# Altium schematic sheet main.SchDoc
size A4; DocumentNumber: 1; SheetNumber: 2; SheetTotal: 5; SPICEModelCacheQOCYWOGJ: <root> / <DocumentId>QOCYWOGJ</DocumentId> / </root>
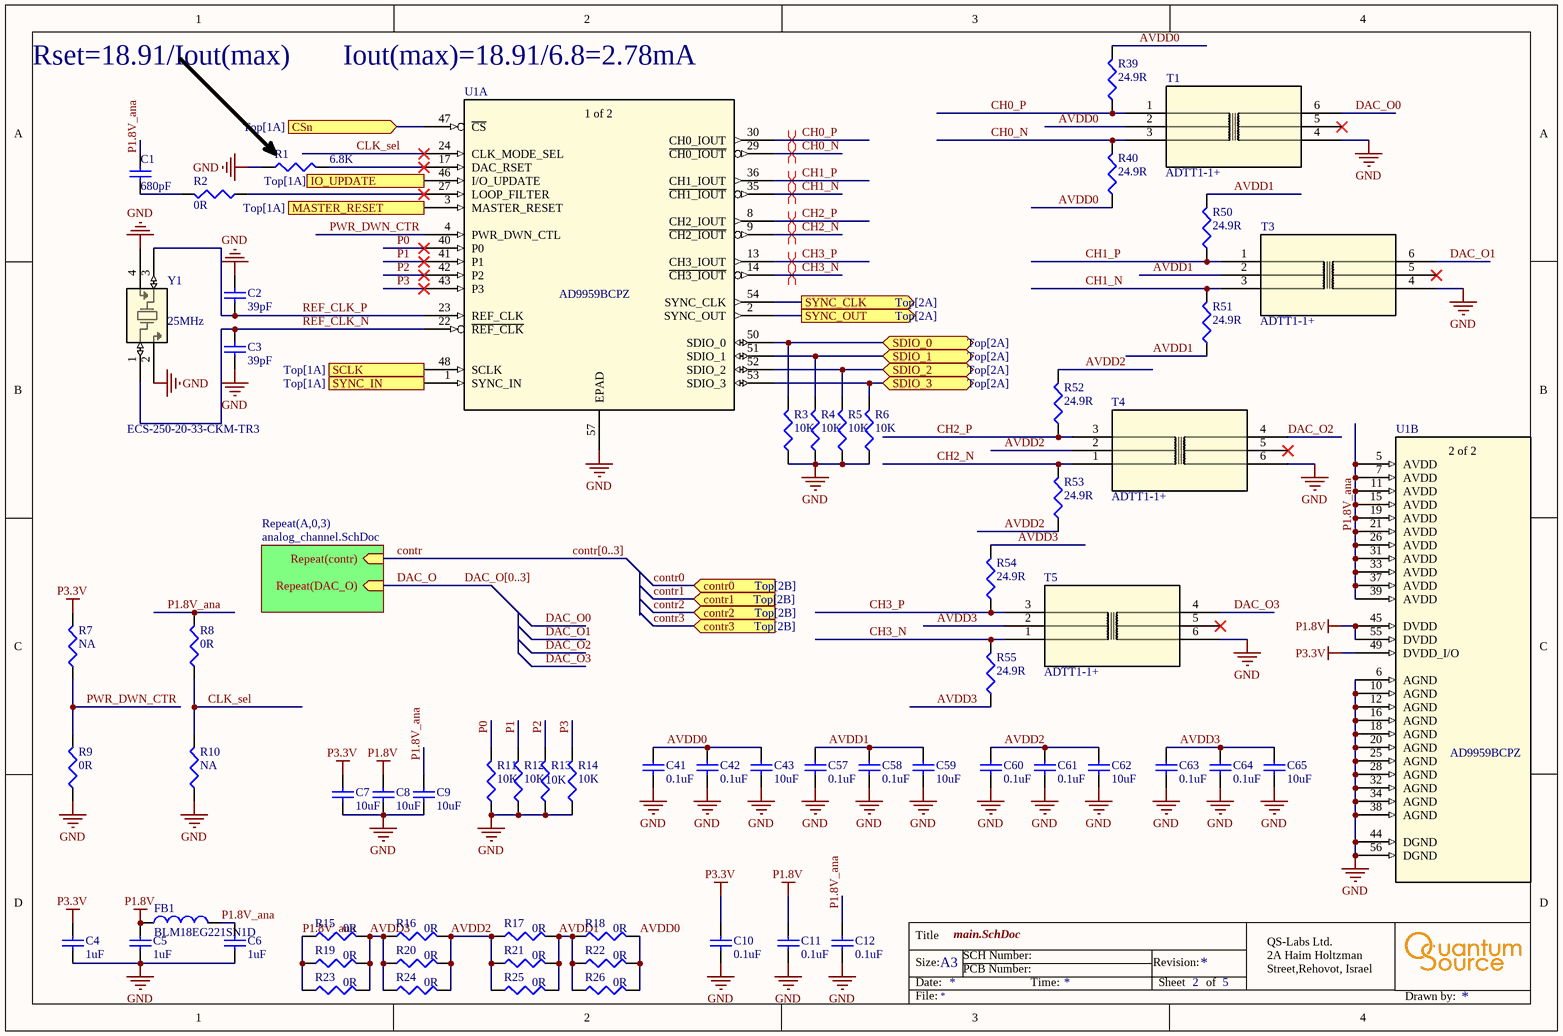
[diagram p0: main.SchDoc]

## Parts
C1  Capacitance: 680pF  [C0402]  (hidden comment: 680pF 50V)
C2  Capacitance: 39pF  [C0402]  (hidden comment: 39pF 50V)
C3  Capacitance: 39pF  [C0402]  (hidden comment: 39pF 50V)
C4  Capacitance: 1uF  [C0402]  (hidden comment: 1uF 25V)
C5  Capacitance: 1uF  [C0402]  (hidden comment: 1uF 25V)
C6  Capacitance: 1uF  [C0402]  (hidden comment: 1uF 25V)
C7  Capacitance: 10uF  [C0402]  (hidden comment: 10uF 10V)
C8  Capacitance: 10uF  [C0402]  (hidden comment: 10uF 10V)
C9  Capacitance: 10uF  [C0402]  (hidden comment: 10uF 10V)
C10  Capacitance: 0.1uF  [C0402]  (hidden comment: 0.1uF 50V)
C11  Capacitance: 0.1uF  [C0402]  (hidden comment: 0.1uF 50V)
C12  Capacitance: 0.1uF  [C0402]  (hidden comment: 0.1uF 50V)
C41  Capacitance: 0.1uF  [C0402]  (hidden comment: 0.1uF 50V)
C42  Capacitance: 0.1uF  [C0402]  (hidden comment: 0.1uF 50V)
C43  Capacitance: 10uF  [C0402]  (hidden comment: 10uF 10V)
C57  Capacitance: 0.1uF  [C0402]  (hidden comment: 0.1uF 50V)
C58  Capacitance: 0.1uF  [C0402]  (hidden comment: 0.1uF 50V)
C59  Capacitance: 10uF  [C0402]  (hidden comment: 10uF 10V)
C60  Capacitance: 0.1uF  [C0402]  (hidden comment: 0.1uF 50V)
C61  Capacitance: 0.1uF  [C0402]  (hidden comment: 0.1uF 50V)
C62  Capacitance: 10uF  [C0402]  (hidden comment: 10uF 10V)
C63  Capacitance: 0.1uF  [C0402]  (hidden comment: 0.1uF 50V)
C64  Capacitance: 0.1uF  [C0402]  (hidden comment: 0.1uF 50V)
C65  Capacitance: 10uF  [C0402]  (hidden comment: 10uF 10V)
FB1  BLM18EG221SN1D  [fb0603]
R1  6.8K  [R0402]
R2  0R  [R0402]
R3  10K  [R0402]
R4  10K  [R0402]
R5  10K  [R0402]
R6  10K  [R0402]
R7  NA  [R0402]
R8  0R  [R0402]
R9  0R  [R0402]
R10  NA  [R0402]
R11  10K  [R0402]
R12  10K  [R0402]
R13  10K  [R0402]
R14  10K  [R0402]
R15  0R  [R0805]
R16  0R  [R0805]
R17  0R  [R0805]
R18  0R  [R0805]
R19  0R  [R0805]
R20  0R  [R0805]
R21  0R  [R0805]
R22  0R  [R0805]
R23  0R  [R0805]
R24  0R  [R0805]
R25  0R  [R0805]
R26  0R  [R0805]
R39  24.9R  [R0402]
R40  24.9R  [R0402]
R50  24.9R  [R0402]
R51  24.9R  [R0402]
R52  24.9R  [R0402]
R53  24.9R  [R0402]
R54  24.9R  [R0402]
R55  24.9R  [R0402]
T1  ADTT1-1+  [CD542_MNC]
T3  ADTT1-1+  [CD542_MNC]
T4  ADTT1-1+  [CD542_MNC]
T5  ADTT1-1+  [CD542_MNC]
U1  AD9959BCPZ  [CP_56_1_ADI]  (parts A,B of 2)
Y1  ECS-250-20-33-CKM-TR3  [SMD4_ECX-32_3p2x2p5_ECS]

## Sub-sheets
Repeat(A,0,3) = analog_channel.SchDoc: Repeat(contr) (in), Repeat(DAC_O) (in)

## Ports
contr0 (in, see Top[2B]), contr1 (in, see Top[2B]), contr2 (in, see Top[2B]), contr3 (in, see Top[2B]), CSn (in, see Top[1A]), IO_UPDATE (in, see Top[1A]), MASTER_RESET (in, see Top[1A]), SCLK (in, see Top[1A]), SDIO_0 (bidir, see Top[2A]), SDIO_1 (bidir, see Top[2A]), SDIO_2 (bidir, see Top[2A]), SDIO_3 (bidir, see Top[2A]), SYNC_CLK (out, see Top[2A]), SYNC_IN (in, see Top[1A]), SYNC_OUT (out, see Top[2A])

## Nets
GND: C2.2 C3.1 C4.1 C5.1 C6.1 C7.1 C8.1 C9.1 C10.1 C11.1 C12.1 C41.1 C42.1 C43.1 C57.1 C58.1 C59.1 C60.1 C61.1 C62.1 C63.1 C64.1 C65.1 R1.1 R3.1 R4.1 R5.1 R6.1 R9.1 R10.1 R11.1 R12.1 R13.1 R14.1 T1.4 T3.4 T4.6 T5.6 U1.6(AGND) U1.10(AGND) U1.12(AGND) U1.16(AGND) U1.18(AGND) U1.20(AGND) U1.25(AGND) U1.28(AGND) U1.32(AGND) U1.34(AGND) U1.38(AGND) U1.44(DGND) U1.56(DGND) U1.57(EPAD) Y1.2 Y1.4
P1.8V: C5.2 C8.2 C11.2 FB1.1 U1.45(DVDD) U1.55(DVDD)
P3.3V: C4.2 C7.2 C10.2 R7.2 U1.49(DVDD_I/O)
AVDD0: C41.2 C42.2 C43.2 R18.2 R22.2 R26.2 R39.2 R40.1 T1.2
AVDD1: C57.2 C58.2 C59.2 R17.2 R18.1 R21.2 R22.1 R25.2 R26.1 R50.2 R51.1 T3.2
AVDD2: C60.2 C61.2 C62.2 R16.2 R17.1 R20.2 R21.1 R24.2 R25.1 R52.2 R53.1 T4.2
AVDD3: C63.2 C64.2 C65.2 R15.2 R16.1 R19.2 R20.1 R23.2 R24.1 R54.2 R55.1 T5.2
CH0_N: R40.2 T1.3 U1.29(~{CH0_IOUT})
CH0_P: R39.1 T1.1 U1.30(CH0_IOUT)
CH1_N: R51.2 T3.3 U1.35(~{CH1_IOUT})
CH1_P: R50.1 T3.1 U1.36(CH1_IOUT)
CH2_N: R53.2 T4.1 U1.9(~{CH2_IOUT})
CH2_P: R52.1 T4.3 U1.8(CH2_IOUT)
CH3_N: R55.2 T5.1 U1.14(~{CH3_IOUT})
CH3_P: R54.1 T5.3 U1.13(CH3_IOUT)
CLK_sel: R8.1 R10.2 U1.24(CLK_MODE_SEL)
contr: sheet Repeat(A,0,3)/Repeat(contr)
contr0: port contr0
contr1: port contr1
contr2: port contr2
contr3: port contr3
CSn: U1.47(~{CS}) ; port CSn
DAC_O: sheet Repeat(A,0,3)/Repeat(DAC_O)
DAC_O0: T1.6
DAC_O1: T3.6
DAC_O2: T4.4
DAC_O3: T5.4
IO_UPDATE: U1.46(I/O_UPDATE) ; port IO_UPDATE
MASTER_RESET: U1.3(MASTER_RESET) ; port MASTER_RESET
P0: R11.2 U1.40(P0)
P1: R12.2 U1.41(P1)
P1.8V_ana: C1.1 C6.2 C9.2 C12.2 FB1.2 R8.2 R15.1 R19.1 R23.1 U1.5(AVDD) U1.7(AVDD) U1.11(AVDD) U1.15(AVDD) U1.19(AVDD) U1.21(AVDD) U1.26(AVDD) U1.31(AVDD) U1.33(AVDD) U1.37(AVDD) U1.39(AVDD)
P2: R13.2 U1.42(P2)
P3: R14.2 U1.43(P3)
PWR_DWN_CTR: R7.1 R9.2 U1.4(PWR_DWN_CTL)
REF_CLK_N: C3.2 U1.22(~{REF_CLK}) Y1.1
REF_CLK_P: C2.1 U1.23(REF_CLK) Y1.3
SCLK: U1.48(SCLK) ; port SCLK
SDIO_0: R3.2 U1.50(SDIO_0) ; port SDIO_0
SDIO_1: R4.2 U1.51(SDIO_1) ; port SDIO_1
SDIO_2: R5.2 U1.52(SDIO_2) ; port SDIO_2
SDIO_3: R6.2 U1.53(SDIO_3) ; port SDIO_3
SYNC_CLK: U1.54(SYNC_CLK) ; port SYNC_CLK
SYNC_IN: U1.1(SYNC_IN) ; port SYNC_IN
SYNC_OUT: U1.2(SYNC_OUT) ; port SYNC_OUT
NetC1_2: C1.2 R2.2
NetR1_2: R1.2 U1.17(DAC_RSET)
NetR2_1: R2.1 U1.27(LOOP_FILTER)

Not connected (* = marked no-connect by the designer): T1 5*; T3 5*; T4 5*; T5 5*

## Buses and harness runs
bus contr[0..3]
bus DAC_O[0..3]

## Layout directives
differential pair: CH0_N, CH0_P, CH1_N, CH1_P, CH2_N, CH2_P, CH3_N, CH3_P

## Notes on the sheet
- Rset=18.91/Iout(max)
- Iout(max)=18.91/6.8=2.78mA
- (near Y1) 25MHz
- Title
- Size:
- Date:
- A3
- PCB Number:
- SCH Number:
- Time:
- Revision:
- Sheet
- of
- QS-Labs Ltd.
  2A Haim Holtzman Street,Rehovot, Israel
- File:
- Drawn by:
- (in symbol AD9959BCPZ, part A) 1 of 2
- (in symbol AD9959BCPZ, part B) 2 of 2

## Library data of the parts
C1 = CAP CER 6.8pF 50V NP0 0402: CAP CER 680PF 50V NP0 0402; Manufacturer Part Number: C1005C0G1H6R8D; Manufacturer: TDK Corporation; LANDA P/N: ECP-000033; RoHS: RoHS Compliant; Package / Case: 0402 (1005 Metric); ComponentLink1URL: http://www.tdk.com/pdf/general_B11.pdf; ComponentLink1Description: http://www.tdk.com/pdf/general_B11.pdf; Voltage - Rated: 50V
C2 C3 = CAP CER 6.8pF 50V NP0 0402: CAP CER 39PF 50V NP0 0402; Manufacturer Part Number: C1005C0G1H6R8D; Manufacturer: TDK Corporation; LANDA P/N: ECP-000033; RoHS: RoHS Compliant; Package / Case: 0402 (1005 Metric); ComponentLink1URL: http://www.tdk.com/pdf/general_B11.pdf; ComponentLink1Description: http://www.tdk.com/pdf/general_B11.pdf; Voltage - Rated: 50V
C4-C6 = CAP CER 6.8pF 50V NP0 0402: CAP CER 1uF 25V X5R 0402; Manufacturer Part Number: C1005C0G1H6R8D; Manufacturer: TDK Corporation; LANDA P/N: ECP-000033; Voltage - Rated: 50V; RoHS: RoHS Compliant; Package / Case: 0402 (1005 Metric); ComponentLink1URL: http://www.tdk.com/pdf/general_B11.pdf; ComponentLink1Description: http://www.tdk.com/pdf/general_B11.pdf
C7-C9 C43 C59 C62 C65 = CAP CER 6.8pF 50V NP0 0402: CAP CER 10uF 10V X5R 0402; Manufacturer Part Number: C1005C0G1H6R8D; Manufacturer: TDK Corporation; LANDA P/N: ECP-000033; Voltage - Rated: 50V; RoHS: RoHS Compliant; Package / Case: 0402 (1005 Metric); ComponentLink1URL: http://www.tdk.com/pdf/general_B11.pdf; ComponentLink1Description: http://www.tdk.com/pdf/general_B11.pdf
C10-C12 C41 C42 C57 C58 C60 C61 C63 C64 = CAP CER 6.8pF 50V NP0 0402: CAP CER 0.1uF 50V NP0 0402; Manufacturer Part Number: C1005C0G1H6R8D; Manufacturer: TDK Corporation; LANDA P/N: ECP-000033; RoHS: RoHS Compliant; Package / Case: 0402 (1005 Metric); ComponentLink1URL: http://www.tdk.com/pdf/general_B11.pdf; ComponentLink1Description: http://www.tdk.com/pdf/general_B11.pdf; Voltage - Rated: 50V
FB1 = BK1608HS600-T: FERRITE BEAD 220_OHM@100MHz 0603 2A 50mohm_DC; Manufacturer: Taiyo Yuden; LANDA P/N: EIN-000010; RoHS: RoHS Compliant; Package / Case: 0603 (1608 Metric); ComponentLink1URL: http://www.yuden.co.jp/ut/product/category/emisuppression/BK1608HS600-T.pdf; ComponentLink1Description: http://www.yuden.co.jp/ut/product/category/emisuppression/BK1608HS600-T.pdf; Manufacturer Part Number: BLM18EG221SN1D
R1 = RES 3.09K OHM 1/16W 1% 0402: RES 6.8K OHM 1/16W 1% 0402; Manufacturer Part Number: RMCF0402FT3K09; Manufacturer: Stackpole Electronics Inc; Power (Watts): 0.063W, 1/16W; LANDA P/N: ERS-000063; Supplier Device Package: 0402; Package / Case: 0402 (1005 Metric); RoHS: RoHS Compliant; ComponentLink1URL: http://www.seielect.com/Catalog/SEI-RMCF_RMCP.pdf; ComponentLink1Description: http://www.seielect.com/Catalog/SEI-RMCF_RMCP.pdf
R2 R7-R10 = RES 100 OHM 1/10W 1% 0402 SMD: RES 0 OHM 1/10W 1% 0402 SMD; Manufacturer Part Number: ERJ-2RKF1000X; Manufacturer: Panasonic Electronic Components; LANDA P/N: ERS-000079; Assembly: N.C; Package / Case: 0402 (1005 Metric); RoHS: RoHS Compliant; ComponentLink1URL: http://industrial.panasonic.com/www-cgi/jvcr13pz.cgi?E+PZ+3+AOA0002+ERJ2RKF1000X+7+WW; ComponentLink1Description: http://industrial.panasonic.com/www-cgi/jvcr13pz.cgi?E+PZ+3+AOA0002+ERJ2RKF1000X+7+WW; Supplier Device Package: 0402
R3-R6 R11-R14 = RES 3.09K OHM 1/16W 1% 0402: RES 10K OHM 1/16W 1% 0402; Manufacturer Part Number: RMCF0402FT3K09; Manufacturer: Stackpole Electronics Inc; Power (Watts): 0.063W, 1/16W; LANDA P/N: ERS-000063; Supplier Device Package: 0402; Package / Case: 0402 (1005 Metric); RoHS: RoHS Compliant; ComponentLink1URL: http://www.seielect.com/Catalog/SEI-RMCF_RMCP.pdf; ComponentLink1Description: http://www.seielect.com/Catalog/SEI-RMCF_RMCP.pdf
R15-R26 = RES 200 OHM 1/8W 1% 0805 SMD: RES 0 OHM 1/8W 1% 0805 SMD; Manufacturer Part Number: RMCF0805FT200R; Manufacturer: Stackpole Electronics Inc; Power (Watts): 0.125W, 1/8W; LANDA P/N: ERS-000050; Package / Case: 0805 (2012 Metric); RoHS: RoHS Compliant; Supplier Device Package: 0805; ComponentLink1URL: http://www.seielect.com/Catalog/SEI-RMCF_RMCP.pdf; ComponentLink1Description: http://www.seielect.com/Catalog/SEI-RMCF_RMCP.pdf
R39 R40 R50-R55 = RES 100 OHM 1/10W 1% 0402 SMD: RES 24.9 OHM 1/10W 1% 0402 SMD; Manufacturer Part Number: ERJ-2RKF1000X; Manufacturer: Panasonic Electronic Components; LANDA P/N: ERS-000079; Assembly: N.C; Package / Case: 0402 (1005 Metric); RoHS: RoHS Compliant; ComponentLink1URL: http://industrial.panasonic.com/www-cgi/jvcr13pz.cgi?E+PZ+3+AOA0002+ERJ2RKF1000X+7+WW; ComponentLink1Description: http://industrial.panasonic.com/www-cgi/jvcr13pz.cgi?E+PZ+3+AOA0002+ERJ2RKF1000X+7+WW; Supplier Device Package: 0402
T1 T3-T5 = ADTT1-1+: No Description Available; Mfr_Name: Mini Circuits; Type: DEV; Copyright: Copyright (C) 2023 Ultra Librarian. All rights reserved.; Manufacturer_Part_Number: ADTT1-1+; RefDes: RefDes
U1 = AD9959BCPZ: No Description Available; Mfr_Name: Analog Devices Inc; Copyright: Copyright (C) 2023 Ultra Librarian. All rights reserved.; Manufacturer_Part_Number: AD9959BCPZ; RefDes: RefDes; Type: DEV
Y1 = ECS-250-20-33-CKM-TR3: No Description Available; Mfr_Name: ECS International; Type: DEV; Copyright: Copyright (C) 2023 Ultra Librarian. All rights reserved.; Manufacturer_Part_Number: ECS-250-20-33-CKM-TR3; RefDes: RefDes